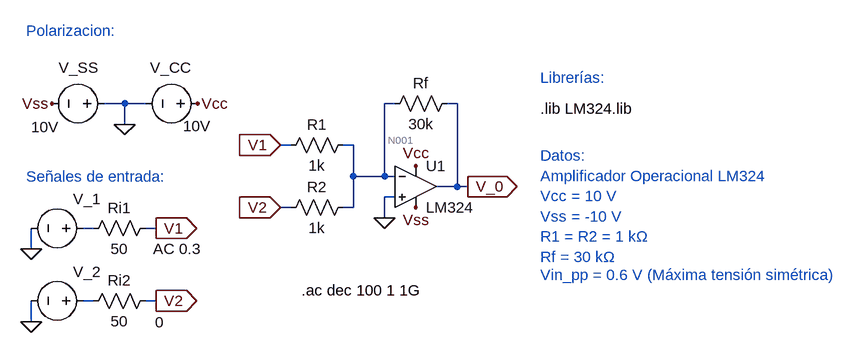
[diagram p0: schematic Lab_2_Circ_1_Ri=50+Respuesta en frecuencia.asc]
Lab_2_Circ_1_Ri=50+Respuesta en frecuencia.asc, the LTspice schematic file:
Version 4
SHEET 1 1560 680
WIRE 32 -256 0 -256
WIRE 64 -256 32 -256
WIRE 448 -256 432 -256
WIRE 544 -256 528 -256
WIRE 32 -224 32 -256
WIRE 288 -192 272 -192
WIRE 384 -192 368 -192
WIRE 384 -144 384 -192
WIRE 432 -144 432 -256
WIRE 432 -144 384 -144
WIRE 448 -144 432 -144
WIRE 544 -128 544 -256
WIRE 544 -128 512 -128
WIRE 560 -128 544 -128
WIRE 448 -112 432 -112
WIRE 288 -96 272 -96
WIRE 384 -96 384 -144
WIRE 384 -96 368 -96
WIRE 432 -80 432 -112
WIRE -16 -64 -32 -64
WIRE 80 -64 64 -64
WIRE -112 -32 -112 -64
WIRE -16 48 -32 48
WIRE 80 48 64 48
WIRE -112 80 -112 48
FLAG 432 -80 0
FLAG 144 -256 Vcc
FLAG 480 -160 Vcc
FLAG -80 -256 Vss
FLAG 480 -96 Vss
FLAG 32 -224 0
FLAG -112 -32 0
FLAG 272 -192 V1
IOPIN 272 -192 In
FLAG 80 -64 V1
IOPIN 80 -64 Out
FLAG 272 -96 V2
IOPIN 272 -96 In
FLAG 560 -128 V_0
IOPIN 560 -128 Out
FLAG -112 80 0
FLAG 80 48 V2
IOPIN 80 48 Out
SYMBOL OpAmps\\opamp2 480 -192 R0
SYMATTR InstName U1
SYMATTR Value LM324
SYMBOL res -32 -48 R270
WINDOW 0 32 56 VTop 2
WINDOW 3 0 56 VBottom 2
SYMATTR InstName Ri1
SYMATTR Value 50
SYMBOL voltage -16 -64 M270
WINDOW 0 45 31 VLeft 2
WINDOW 3 1 -53 VLeft 2
WINDOW 123 -32 -92 VLeft 2
WINDOW 39 0 0 Left 0
SYMATTR InstName V_1
SYMATTR Value ""
SYMATTR Value2 AC 0.3
SYMBOL voltage 160 -256 R90
WINDOW 0 -55 25 VRight 2
WINDOW 3 35 -5 VRight 2
WINDOW 123 0 0 Left 0
WINDOW 39 0 0 Left 0
SYMATTR InstName V_CC
SYMATTR Value 10V
SYMBOL voltage 16 -256 R90
WINDOW 0 -55 25 VRight 2
WINDOW 3 36 85 VRight 2
WINDOW 123 0 0 Left 0
WINDOW 39 0 0 Left 0
SYMATTR InstName V_SS
SYMATTR Value 10V
SYMBOL res -32 64 R270
WINDOW 0 32 56 VTop 2
WINDOW 3 0 56 VBottom 2
SYMATTR InstName Ri2
SYMATTR Value 50
SYMBOL voltage -16 48 M270
WINDOW 0 45 31 VLeft 2
WINDOW 3 -33 -95 VLeft 2
WINDOW 123 0 0 Left 0
WINDOW 39 0 0 Left 0
SYMATTR InstName V_2
SYMATTR Value 0
SYMBOL res 384 -208 R90
WINDOW 0 0 56 VBottom 2
WINDOW 3 32 56 VTop 2
SYMATTR InstName R1
SYMATTR Value 1k
SYMBOL res 384 -112 R90
WINDOW 0 0 56 VBottom 2
WINDOW 3 32 56 VTop 2
SYMATTR InstName R2
SYMATTR Value 1k
SYMBOL res 544 -272 R90
WINDOW 0 0 56 VBottom 2
WINDOW 3 32 56 VTop 2
SYMATTR InstName Rf
SYMATTR Value 30k
TEXT 672 -248 Left 2 !.lib LM324.lib
TEXT 672 -296 Left 2 ;Librerías:
TEXT -120 -368 Left 2 ;Polarizacion:
TEXT -120 -144 Left 2 ;Señales de entrada:
TEXT 672 -176 Left 2 ;Datos:\nAmplificador Operacional LM324\nVcc = 10 V\nVss = -10 V\nR1 = R2 = 1 kΩ\nRf = 30 kΩ
TEXT 304 32 Left 2 !.ac dec 100 1 1G
TEXT 672 8 Left 2 ;Vin_pp = 0.6 V (Máxima tensión simétrica)

The netlist it stands for:
* Lab_2_Circ_1_Ri=50+Respuesta en frecuencia.asc
XU1 0 N001 Vcc Vss V_0 LM324  ; pins In+ In- V+ V- OUT
Ri1 N002 V1 50
V_1 N002 0 AC 0.3
V_CC Vcc 0 10V
V_SS 0 Vss 10V
Ri2 N003 V2 50
V_2 N003 0 0
R1 N001 V1 1k
R2 N001 V2 1k
Rf V_0 N001 30k
.lib LM324.lib
* Librerías:
* Polarizacion:
* Señales de entrada:
* Datos:
* Amplificador Operacional LM324
* Vcc = 10 V
* Vss = -10 V
* R1 = R2 = 1 kΩ
* Rf = 30 kΩ
.ac dec 100 1 1G
* Vin_pp = 0.6 V (Máxima tensión simétrica)
.backanno
.end

* Results of the author's LTspice run, read from the files saved beside the schematic
* Operating Point, zero values left out:
*   V(v_0) = -2.554 mV
*   V(vss) = -10 V
*   V(vcc) = 10 V
*   V(n001) = -33.63 µV
*   V(v1) = -1.601 µV
*   V(v2) = -1.601 µV
*   I(Rf) = -84 nA
*   I(R2) = -32.03 nA
*   I(R1) = -32.03 nA
*   I(Ri2) = 32.03 nA
*   I(Ri1) = 32.03 nA
*   I(V_2) = -32.03 nA
*   I(V_ss) = -669.8 µA
*   I(V_cc) = -669.9 µA
*   I(V_1) = -32.03 nA
*   Ix(u1:1) = -19.92 nA
*   Ix(u1:2) = -19.94 nA
*   Ix(u1:3) = 669.9 µA
*   Ix(u1:4) = -669.8 µA
*   Ix(u1:5) = 84 nA